# EasyEDA Pro project sfy3-v3.1.4.epro, board PCB_sfy3
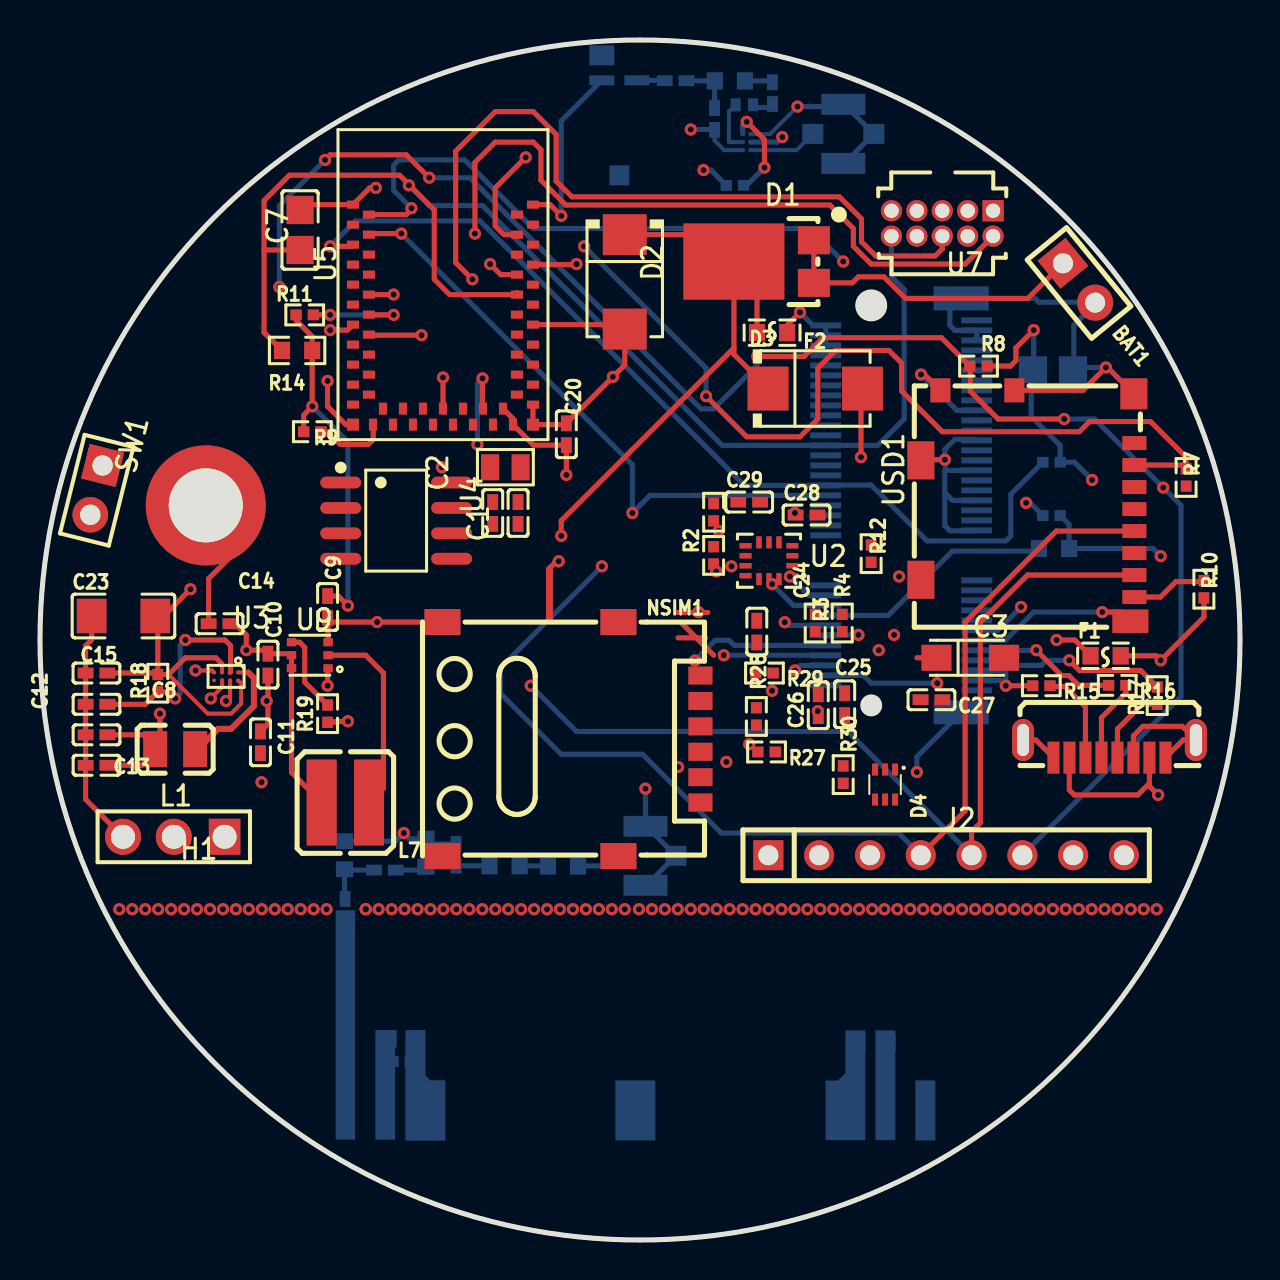
[diagram p30: board, top side]
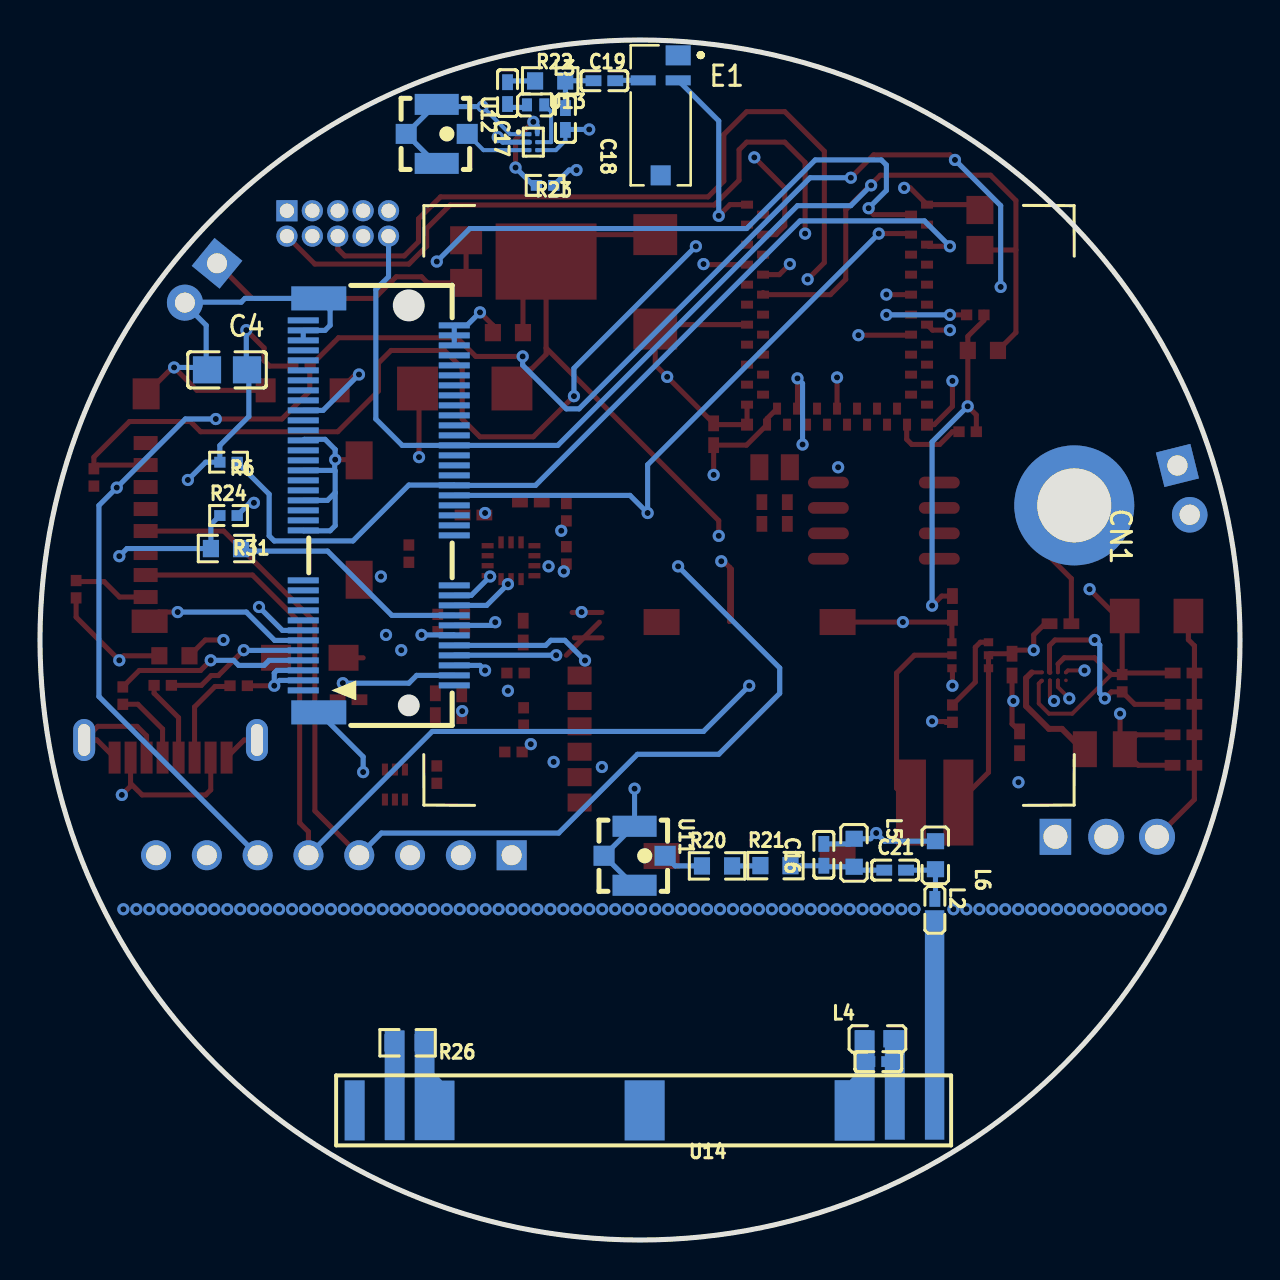
[diagram p31: board, bottom side, seen from below]

Outline 60 x 60 mm; copper layers: Top Layer, GND, POWER, Bottom Layer. Coordinates in mm from the lower left corner of the outline.
Outline path: circle c30,30 r30
Stack: Top Layer 0.035mm 外层铜厚1oz / Dielectric1 0.2104mm 7628 RC49% 8.6mil / GND 0.0152mm 内层铜厚 / Dielectric2 1.065mm 1.1mm H/HOZ 含铜 / POWER 0.0152mm 内层铜厚 / Dielectric3 0.2104mm 7628 RC49% 8.6mil / Bottom Layer 0.035mm 外层铜厚1oz

## Design rules (mm)
template: User Custom Config
spacing Default (default): track to track 0.152, other pairs 0 to 0.152
track width Default (default): min 0.254, default 0.254, max 25.4
differential pair differentialPair (default): width min 0.127, default 0.254, max 2.54; gap min 0.152, default 0.152
via Default (default): diameter min 0.61, default 0.61, max 100.025; hole min 0.305, default 0.305, max 59.995

## Placement (name value [footprint] x y rotation side)
BAT1  22284020  [HDR-TH_2P-P2.54-V-M-1]  51.95 47.85 309.3 top
C1  15pF  [C0402]  23.9 36.35 270 top
C2  15pF  [C0402]  22.63 36.35 270 top
C3  10uF  [CAP-SMD_L3.2-W1.6-RD]  46.51 29.11 0 top
C4  100nF  [C0805]  50.65 43.51 180 bottom
C7  1nF  [C0805]  13 50.5 90 top
C8  100nF  [C0402]  2.83 26.78 180 top
C9  100nF  [C0402]  14.38 31.65 270 top
C10  100nF  [C0402]  11.4 28.77 270 top
C11  10uF  [C0402]  11.02 24.88 90 top
C12  10uF  [C0402]  2.83 25.26 180 top
C13  10uF  [C0402]  2.83 23.74 180 top
C14  10uF  [C0402]  8.98 30.81 180 top
C15  4.7uF  [C0402]  2.82 28.35 0 top
C16  1pF  [C0402]  20.81 19.26 270 bottom
C17  1nF  [C0402]  36.62 57.34 90 bottom
C18  4.6pF  [C0402]  33.73 56.05 90 bottom
C19  1.1pF  [C0402]  31.78 57.96 180 bottom
C20  1uF  [C0402]  26.32 40.29 270 top
C21  2.2pF  [C0402]  17.24 18.49 180 bottom
C22  0.5pF  [C0402]  18.09 8.92 0 bottom
C23  47uF  [C1206]  4.17 31.2 0 top
C24  100nF  [C0402]  35.84 30.42 270 top
C25  33pF  [C0402]  40.23 26.79 90 top
C26  33pF  [C0402]  38.91 26.74 90 top
C27  33pF  [C0402]  44.57 27.01 180 top
C28  100nF  [C0402]  38.33 36.25 0 top
C29  100nF  [C0402]  35.46 36.9 0 top
CN1  NOTECARD CONNECTOR  [NOTECARD-ext]  9.81 36.73 270 bottom
D1  FSV1045V  [TO-277A_L6.1-W4.6-P2.13-LS6.5-TR]  36.7 48.92 0 top
D2  SM6T6V8A  [SMB_L4.6-W3.6-LS5.3-RD]  29.24 47.91 270 top
D3  STPS3H100U  [SMB_L4.6-W3.6-LS5.3-RD]  38.76 42.57 0 top
D4  CESDLC5V0M5  [SOT-563_L1.6-W1.2-P0.50-LS1.6-BR]  42.25 22.77 90 top
E1  -  [NN03-320]  28.97 56.23 90 bottom
F1  046701.5NRHF  [F0603]  53.28 29.21 0 top
F2  F0603FA3500V032T  [F0603]  36.6 45.37 180 top
H1  Header-Male-2.54_1x3  [HDR-TH_3P-P2.54-V-M-1]  6.69 20.16 180 top
J2  Header2.54mm 1*8P  [HDR-TH_8P-P2.54-V-M]  45.31 19.24 0 top
L1  2.2uH  [L0806]  6.76 24.54 0 top
L2  2.3nH  [L0402]  15.26 16.51 270 bottom
L3  7.5nH  [IND-SMD_L1.0-W0.6]  35.22 56.76 0 bottom
L4  12nH  [L0603]  18.14 10.06 0 bottom
L5  10nH  [L0603]  19.29 19.36 90 bottom
L6  8.4nH  [L0603]  15.23 19.24 90 bottom
L7  2.2uH  [IND-SMD_L4.0-W4.0_XAL4040-103]  15.27 21.87 180 top
NSIM1  SMN-305  [SIM-SMD_SMN-305]  26.57 25.05 270 top
R2  10kΩ  [R0402]  33.68 34.23 90 top
R3  10kΩ  [R0402]  38.76 30.85 270 top
R4  10kΩ  [R0402]  40.11 30.85 270 top
R5  10kΩ  [R0402]  33.68 36.39 270 top
R6  10kΩ  [R0402]  50.57 38.89 0 bottom
R7  10kΩ  [R0402]  57.31 38.13 270 top
R8  10kΩ  [R0402]  46.93 43.7 0 top
R9  10kΩ  [R0402]  13.62 40.41 180 top
R10  10kΩ  [R0402]  58.19 32.54 270 top
R11  10kΩ  [R0402]  13.24 46.26 180 top
R12  10kΩ  [R0402]  41.56 34.32 270 top
R14  100kΩ  [R0603]  12.86 44.48 0 top
R15  5.1kΩ  [R0402]  50.07 27.71 180 top
R16  22Ω  [R0402]  53.86 27.73 180 top
R17  22Ω  [R0402]  55.86 27.22 90 top
R18  10MΩ  [R0402]  5.89 27.84 90 top
R19  82kΩ  [R0402]  14.38 26.32 90 top
R20  0Ω  [R0603]  26.15 18.7 180 bottom
R21  0Ω  [R0603]  23.23 18.72 180 bottom
R22  0Ω  [R0603]  34.49 57.95 180 bottom
R23  200kΩ  [R0402]  34.74 52.73 180 bottom
R24  100kΩ  [R0402]  50.57 36.22 180 bottom
R26  0Ω  [R0603]  41.62 9.86 0 bottom
R27  22Ω  [R0402]  36.33 24.4 180 top
R28  22Ω  [R0402]  35.82 26.18 270 top
R29  22Ω  [R0402]  36.22 28.35 180 top
R30  15kΩ  [R0402]  40.16 23.27 270 top
R31  0Ω  [R0603]  50.7 34.57 0 bottom
SW1  M.sw.  [2P]  2.82 37.49 256 top
U2  ISM330DHCXTR  [LGA-14_L3.0-W2.5-P0.50-BR]  36.45 33.96 0 top
U3  TPS62748YFPT  [DSBGA-8_L1.6-W0.9-R2-C4-P0.40-BL]  9.3 28.18 180 top
U4  DS2482S-100+T&R  [SOIC-8_L4.9-W3.9-P1.27-LS6.0-BL]  17.81 35.97 270 top
U5  SPARKFUN ARTEMIS BLE MODULE  [ARTEMIS_BLE]  15.65 40.77 90 top
U6  32.768kHz  [CRYSTAL-SMD_L2.0-W1.2]  23.27 38.64 180 top
U7  FTSH-105-01-F-D-K  [CONN-TH_10P-P1.27_FTSH-105-01-F-D-K]  45.11 50.83 180 top
U9  MAX17225ELT+T  [UDFN-6_L2.0-W2.0-P0.65-BL]  13.49 29.24 90 top
U11  CONMHF1-SMD-G-T  [RF-SMD_CONMHF1-SMD-G-T]  30.27 19.21 270 bottom
U12  CONMHF1-SMD-G-T  [RF-SMD_CONMHF1-SMD-G-T]  40.16 55.31 270 bottom
U13  BGA725L6E6327FTSA1  [TSLP-6_L1.1-W0.7-P0.40-BR]  35.33 54.89 0 bottom
U14  -  [NN03-310-NoSilk]  15.27 6.5 0 bottom
USB1  YTC-TC8S-125  [USB-C-SMD_YIYUAN_YTC-TC8S-125]  53.47 24.56 0 top
USD1  1040310811  [SIM-SMD_8P-1040310811]  49.38 36.71 90 top

## Footprints (pads in the part's own frame, mm; a bottom-side part is the same pattern mirrored in y, then rotated)
2P
  rect 1.778x1.778 hole 1.016: 1(-1.27,0)
  round 1.778 hole 1.016: 2(1.27,0)
ARTEMIS_BLE
  rect 0.4x0.6 smd: 1(11,0) 2(10.5,-0.8) 3(10,0) 4(9.5,-0.8) 5(9,0) 6(8.5,-0.8) 7(8,0) 8(7.5,-0.8) 9(7,0) 10(6.5,-0.8) 11(6,0) 12(5.5,-0.8) 13(5,0) 14(4.5,-0.8) 15(4,0) 16(3.5,-0.8) 17(3,0) 18(2.5,-0.8) 19(2,0) 20(1.5,-0.8) 21(1,0) 39(1,-8.999) 40(1.5,-8.2) 41(2,-8.999) 42(2.5,-8.2) 43(3,-8.999) 44(3.5,-8.2) 45(4,-8.999) 46(4.5,-8.2) 47(5,-8.999) 48(5.5,-8.2) 49(6,-8.999) 50(6.5,-8.2) 51(7,-8.999) 52(7.5,-8.2) 53(8,-8.999) 54(8.5,-8.2) 55(9,-8.999) 56(9.5,-8.2) 57(10,-8.999) 58(10.5,-8.2) 59(11,-8.999)
  rect 0.6x0.6 smd: 22(0,0) 38(0,-8.999)
  rect 0.6x0.4 smd: 23(0,-1) 24(0.8,-1.5) 25(0,-2) 26(0.8,-2.5) 27(0,-2.999) 28(0.8,-3.5) 29(0,-3.999) 30(0.8,-4.5) 31(0,-5) 32(0.8,-5.5) 33(0,-6) 34(0.8,-6.5) 35(0,-7) 36(0.8,-7.5) 37(0,-8)
C0402
  rect 0.79x0.54 smd: 1(-0.545,0) 2(0.545,0)
C0805
  rect 1.41x1.35 smd: 1(-1,0) 2(1,0)
C1206
  rect 1.485x1.728 smd: 1(-1.593,0) 2(1.593,0)
CAP-SMD_L3.2-W1.6-RD
  rect 1.5x1.296 smd: 1(-1.687,0) 2(1.687,0)
CONN-TH_10P-P1.27_FTSH-105-01-F-D-K
  rect 1.06x1.06 hole 0.715x0.71: 1(-2.54,-0.635)
  round 1.06 hole 0.715x0.71: 2(-2.54,0.635) 3(-1.27,-0.635) 4(-1.27,0.635) 5(0,-0.635) 6(0,0.635) 7(1.27,-0.635) 8(1.27,0.635) 9(2.54,-0.635) 10(2.54,0.635)
CRYSTAL-SMD_L2.0-W1.2
  rect 0.9x1.3 smd: 1(-0.762,0) 2(0.762,0)
DSBGA-8_L1.6-W0.9-R2-C4-P0.40-BL
  round 0.184 smd: A1(-0.6,-0.2) A2(-0.6,0.2) B1(-0.2,-0.2) B2(-0.2,0.2) C1(0.2,-0.2) C2(0.2,0.2) D1(0.6,-0.2) D2(0.6,0.2)
F0603
  rect 0.806x0.864 smd: 1(-0.753,0) 2(0.753,0)
HDR-TH_2P-P2.54-V-M-1
  rect 1.8x1.8 hole 1: 1(-1.27,0)
  round 1.8 hole 1: 2(1.27,0)
HDR-TH_3P-P2.54-V-M-1
  rect 1.575x1.8 hole 1.2: 1(-2.54,0)
  round 1.8 hole 1.2: 2(0,0) 3(2.54,0)
HDR-TH_8P-P2.54-V-M
  rect 1.5x1.5 hole 1: 1(-8.89,0)
  round 1.5 hole 1: 2(-6.35,0) 3(-3.81,0) 4(-1.27,0) 5(1.27,0) 6(3.81,0) 7(6.35,0) 8(8.89,0)
IND-SMD_L1.0-W0.6
  rect 0.5x0.648 smd: 1(-0.434,0) 2(0.434,0)
IND-SMD_L4.0-W4.0_XAL4040-103
  rect 1.5x4.3 smd: 1(-1.185,0) 2(1.185,0)
L0402
  rect 0.79x0.54 smd: 1(-0.545,0) 2(0.545,0)
L0603
  rect 0.8x0.864 smd: 1(-0.7,0) 2(0.7,0)
L0806
  rect 1.2x1.8 smd: 1(-1,0) 2(1,0)
LGA-14_L3.0-W2.5-P0.50-BR
  rect 0.6x0.27 smd: 1(1.17,-0.75) 2(1.17,-0.25) 3(1.17,0.25) 4(1.17,0.75) 8(-1.17,0.75) 9(-1.17,0.25) 10(-1.17,-0.25) 11(-1.17,-0.75)
  rect 0.27x0.6 smd: 5(0.5,0.92) 6(0,0.92) 7(-0.5,0.92) 12(-0.5,-0.92) 13(0,-0.92) 14(0.5,-0.92)
NN03-310-NoSilk
  custom 0.97x11.48 smd: 1(0.003,-4.242)
  custom 0.992x5.499 smd: 2(1.994,-1.238)
  custom 2.001x5.513 smd: 3(4,-1.22)
  rect 2x3 smd: 4(14.5,0.025)
  custom 1.986x5.486 smd: 5(25.003,-1.232)
  custom 0.992x5.486 smd: 6(27,-1.232)
  rect 1x3 smd: 7(29,0.025)
NN03-320
  rect 1x1 smd: 1(-3,0)
  custom 0.5x1.25 smd: 2(1.75,-0.875) 4(1.75,0.875)
  custom 1x1.25 smd: 3(3,-0.875)
NOTECARD-ext
  round 6 hole 3.7: 0(0,1.524)
  rect 0.3x1.55 smd: 1(9.25,-37.025) 2(9,-29.475) 3(8.751,-37.025) 4(8.5,-29.475) 5(8.25,-37.025) 6(8,-29.475) 7(7.75,-37.025) 8(7.5,-29.475) 9(7.25,-37.025) 10(7,-29.475) 11(6.75,-37.025) 12(6.5,-29.475) 13(6.25,-37.025) 14(6,-29.475) 15(5.75,-37.025) 16(5.5,-29.475) 17(5.25,-37.025) 18(5,-29.475) 19(4.75,-37.025) 20(4.5,-29.475) 21(4.25,-37.025) 22(4,-29.475) 23(3.751,-37.025) 32(1.5,-29.475) 33(1.25,-37.025) 34(1,-29.475) 35(0.75,-37.025) 36(0.5,-29.475) 37(0.25,-37.025) 38(0.001,-29.475) 39(-0.249,-37.025) 40(-0.5,-29.475) 41(-0.75,-37.025) 42(-1,-29.475) 43(-1.25,-37.025) 44(-1.5,-29.475) 45(-1.75,-37.025) 46(-2,-29.475) 47(-2.249,-37.025) 48(-2.5,-29.475) 49(-2.75,-37.025) 50(-2.999,-29.475) 51(-3.249,-37.025) 52(-3.5,-29.475) 53(-3.75,-37.025) 54(-3.999,-29.475) 55(-4.25,-37.025) 56(-4.5,-29.475) 57(-4.75,-37.025) 58(-5,-29.475) 59(-5.25,-37.025) 60(-5.5,-29.475) 61(-5.75,-37.025) 62(-6,-29.475) 63(-6.25,-37.025) 64(-6.5,-29.475) 65(-6.75,-37.025) 66(-7,-29.475) 67(-7.25,-37.025) 68(-7.5,-29.475) 69(-7.75,-37.025) 70(-8,-29.475) 71(-8.249,-37.025) 72(-8.5,-29.475) 73(-8.75,-37.025) 74(-8.999,-29.475) 75(-9.249,-37.025)
  rect 1.2x2.75 smd: 76(-10.35,-36.25) 77(10.35,-36.25)
R0402
  rect 0.566x0.54 smd: 1(-0.433,0) 2(0.433,0)
R0603
  rect 0.806x0.864 smd: 1(-0.753,0) 2(0.753,0)
RF-SMD_CONMHF1-SMD-G-T
  rect 1x1.05 smd: 1(0,1.525) 4(0,-1.525)
  rect 1.05x2.2 smd: 2(-1.475,0) 3(1.475,0)
SIM-SMD_8P-1040310811
  rect 0.7x1.2 smd: 1(3.138,-5.338) 2(2.038,-5.338) 3(0.938,-5.338) 4(-0.163,-5.338) 5(-1.262,-5.338) 6(-2.362,-5.338) 7(-3.462,-5.338) 8(-4.562,-5.338)
  rect 1.17x1.8 smd: 9(-5.772,-5.138)
  rect 1.55x1.35 smd: 10(5.598,-5.312)
  rect 1.2x1 smd: 11(5.772,0.662) 12(5.772,4.362)
  rect 1.9x1.35 smd: 13(2.272,5.338) 14(-3.697,5.338)
SIM-SMD_SMN-305
  rect 1.3x1.8 smd: 1(5.85,-6.45) 2(-5.85,-6.45) 3(5.85,2.35) 4(-5.85,2.35)
  rect 0.9x1.2 smd: C1(-3.175,6.45) C2(-0.635,6.45) C3(1.905,6.45) C5(-1.905,6.45) C6(0.635,6.45) C7(3.175,6.45)
SMB_L4.6-W3.6-LS5.3-RD
  rect 2.047x2.192 smd: 1(-2.361,0) 2(2.361,0)
SOIC-8_L4.9-W3.9-P1.27-LS6.0-BL
  oval 0.588x2.045 smd: 1(-1.905,-2.772) 2(-0.635,-2.772) 3(0.635,-2.772) 4(1.905,-2.772) 5(1.905,2.772) 6(0.635,2.772) 7(-0.635,2.772) 8(-1.905,2.772)
SOT-563_L1.6-W1.2-P0.50-LS1.6-BR
  rect 0.6x0.3 smd: 1(0.75,-0.5) 2(0.75,0) 3(0.75,0.5) 4(-0.75,0.5) 5(-0.75,0) 6(-0.75,-0.5)
TO-277A_L6.1-W4.6-P2.13-LS6.5-TR
  rect 1.6x1.4 smd: 1(2,1.065) 2(2,-1.065)
  rect 5.05x3.81 smd: 3(-2,0)
TSLP-6_L1.1-W0.7-P0.40-BR
  rect 0.2x0.2 smd: 1(0.2,-0.4) 2(0.2,0) 3(0.2,0.4) 4(-0.2,0.4) 5(-0.2,0) 6(-0.2,-0.4)
UDFN-6_L2.0-W2.0-P0.65-BL
  rect 0.4x0.47 smd: 1(-0.65,-0.915) 2(0,-0.915) 3(0.65,-0.915) 4(0.65,0.915) 5(0,0.915) 6(-0.65,0.915)
USB-C-SMD_YIYUAN_YTC-TC8S-125
  oval 1.1x2.1 hole 0.6x1.6: 10(4.32,0.44) 11(-4.32,0.44)
  rect 0.6x1.6 smd: A5(-1.2,-0.44) A8(1.2,-0.44) A9(2,-0.44) A12(2.8,-0.44) B6(0.4,-0.44) B7(-0.4,-0.44) B9(-2,-0.44) B12(-2.8,-0.44)

## Nets
As in the schematic.

Pads without a net: CN1 1 15 17 19 21 22 23 32 34 35 36 37 38 41 43 44 46 47 48 49 52 53 54 55 56 58 59 60 61 62 63 64 65 66 67 68 69 75; D4 1; E1 1 3; J2 3 8; NSIM1 C6; U2 2 3 4 9 10 11; U3 D2; U4 6; U5 3 6 7 8 9 11 15 16 17 18 19 20 21 24 25 26 27 28 29 31 32 33 40 41 42 43 44 45 46 48 49 51 54 55 57 58; U7 7 8; U14 4 7

## Via types
v1: diameter 0.61, hole 0.305, Top Layer to Bottom Layer, 180 vias

## Routing (per net, layer and track width the routed paths; a pad name or vN(x,y) marks a point on that pad's centre or on a via; arc(x,y) is an arc through that point)
1V8: length 27.2
  Top Layer w0.2: v1(8.54,27.08) 9.1,27.65 9.1,27.98
  Top Layer w0.254: 5.89,24.54 5.08,23.74 3.37,23.74 ; 5.89,24.54 6,24.65 v1(6,26.32) ; 5.89,24.54 5.17,25.26 3.37,25.26 ; C14.1 9.76,30.81 10.32,30.25 v1(10.32,29.49) 11.22,29.49 C10.1 12.5,29.31 U9.5 U9.6 12.58,23.38 L7.2
  POWER w0.254: v1(10.32,29.49) 9.55,29.49 8.54,28.48 v1(8.54,27.08) 7.78,26.32 v1(6,26.32)
+3V3: length 152.3
  Top Layer w0.254: U9.1 14.38,28.56 v1(14.38,27.71) ; 12.8,46.38 12.8,45.99 13.61,45.18 R14.2 13.61,41.69 v1(13.62,41.68) 13.18,41.25 R9.2 ; R10.2 58.19,31.14 v1(56.03,28.98) 55.81,29.21 F1.2 ; v1(49.69,45.49) 48.8,44.61 48.8,43.97 48.52,43.7 R8.2 ; v1(15.4,31.72) 14.92,32.2 C9.1 ; U5.36 23.65,41.07 U5.37 24.67,39.74 C20.2 v1(26.32,38.26) ; 43.84,29.11 C3.1
  POWER w0.254: H1.2 6.69,21.8 7.39,22.51 10.7,22.51 v1(11.08,22.89) 11.08,25.05 13.74,27.71 v1(14.38,27.71) 14.89,27.71 15.4,28.22 v1(15.4,31.72) 15.58,31.91 31.52,31.91 ; v1(32.92,31.4) 33.3,31.4 33.68,31.78 41.18,31.78 v1(42.7,30.25) 43.26,30.81 54.21,30.81 v1(56.03,28.98) ; v1(32.92,31.4) 32.79,31.4 ; v1(32.92,31.4) 29.37,27.84 29.37,25.05 35.17,19.24 J2.1 ; v1(32.92,31.4) 32.41,31.91 31.52,31.91 ; v1(49.69,45.49) 48.92,46.26 48.92,50.83 48.29,51.46 U7.1 47.65,51.97 45.75,53.88 38.38,53.88 v1(37.11,55.15) ; v1(26.32,38.26) 26.32,37.11 31.52,31.91
  Bottom Layer w0.254: v1(37.11,55.15) 36.86,54.89 U13.2 ; v1(52.61,38) 51.72,38.89 R6.2 51.01,39.73 49.56,41.18 49.56,43.42 C4.2 49.69,43.55 v1(49.69,45.49) ; v1(13.62,41.68) 15.4,39.91 v1(15.4,31.72)
GND: length 170.9
  Top Layer w0.2: 8.7,28.38 8.61,28.48 v1(7.78,28.48) ; 9.5,27.98 9.5,27.16 v1(9.3,26.95)
  Top Layer w0.254: USB1.11 49.79,25 USB1.B12 ; NSIM1.2 v1(16.86,30.9) 14.59,30.9 14.41,31.08 ; 25.52,33.63 25.43,33.54 25.43,31.02 25.52,30.93 25.52,33.63 ; 25.52,33.63 25.82,33.94 v1(25.94,33.94) ; 11.4,27.02 11.4,25.8 C11.2 ; 11.4,27.02 C10.2 ; 11.4,27.02 v1(11.33,26.95) ; v1(48.29,27.71) R15.2 ; C7.2 13.27,51.77 U5.1 16.49,52.61 v1(16.79,52.61) ; U5.47 29.02,45.77 D2.2 29.24,43.75 v1(28.64,43.16) C20.1 26.25,40.77 U5.38 U5.39 ; H1.3 2.28,22.03 C13.2 C12.2 C8.2 2.28,28.34 C15.1 2.28,29.71 2.58,30.01 C23.1 ; USD1.10 53.37,43.63 v1(53.3,43.63) 52.15,42.48 USD1.11 ; v1(53.11,31.4) 54.06,31.4 USD1.9 ; U5.59 25.5,51.77 v1(26.06,51.21) ; U9.3 14.41,31.08 ; 14.41,31.08 C9.2 ; v1(14.38,42.95) 14.38,41.68 15.29,40.77 U5.22 ; USB1.A8 54.67,25.21 55.15,25.68 57.11,25.68 USB1.10 57.15,25 USB1.A12 ; v1(15.4,25.94) 15.38,25.92 14.75,25.92 ; 9.81,36.73 9.81,34.45 8.43,33.07 C14.2 ; 14.75,25.92 14.71,25.88 R19.1 ; 14.75,25.92 14.33,25.92 ; v1(44.05,43.27) 44.23,43.27 USD1.12 ; 31.9,30.11 33.28,30.11 ; v1(45.24,39.02) 44.08,39.02
  Bottom Layer w0.2: U13.1 36.5,55.29 v1(37.87,56.67) ; C18.1 33.73,54.97 34.21,54.49 U13.4
  Bottom Layer w0.254: C18.1 33.71,55.53 v1(32.54,55.53) ; 51.69,43.55 51.77,43.63 v1(53.3,43.63) ; 51.69,43.55 51.69,45.73 52.79,46.84 ; 51.69,43.55 51.69,43.51 ; BAT1.2 52.73,46.89 49.94,46.89 49.75,47.08 CN1.76 45.49,46.51 45.49,45.73 45.75,45.48 CN1.73 CN1.71 ; C16.1 19.55,19.8 L5.2 18.47,20.06 v1(18.19,20.35) 17.78,19.94 L6.2 ; CN1.39 45.63,36.98 45.24,37.37 ; CN1.45 45.27,38.48 ; 45.27,38.48 45.24,38.45 45.24,37.37 ; 45.27,38.48 45.27,38.99 v1(45.24,39.02) 45.24,39.53 45.75,40.03 46.78,40.03 CN1.51 ; CN1.18 37.67,31.73 v1(36.6,32.79) ; v1(26.06,51.21) 26.06,55.95 28.09,57.98 ; CN1.33 46.82,35.46 45.49,35.46 45.24,35.72 45.24,37.37 ; CN1.6 38,28.73 v1(37.75,28.48) ; CN1.57 45.84,41.48 v1(44.05,43.27) ; v1(37.87,56.67) 40.05,56.67 U12.2 40.21,56.78 U12.4 40.21,53.83 U12.3 ; v1(56.03,34.19) 55.65,34.57 R31.2 51.45,35.78 R24.1 ; CN1.3 48.02,27.98 v1(48.29,27.71) 48.29,28.35 48.16,28.48 CN1.5 ; 46.06,26.38 43.84,24.16 v1(43.84,23.4) ; U11.3 30.32,17.74 U11.4 30.32,20.69 U11.2 v1(30.27,22.57) ; 51.66,43.36 51.73,43.43 ; v1(53.11,31.4) 49.69,31.4 48.27,29.98 CN1.11
  vias: v1(3.97,16.54) v1(4.61,16.54) v1(5.26,16.54) v1(5.91,16.54) v1(6.56,16.54) v1(7.2,16.54) v1(7.85,16.54) v1(8.5,16.54) v1(9.15,16.54) v1(9.79,16.54) v1(10.44,16.54) v1(11.09,16.54) v1(11.74,16.54) v1(12.39,16.54) v1(13.03,16.54) v1(13.68,16.54) v1(14.33,16.54) v1(16.28,16.54) v1(16.28,16.54) v1(16.93,16.54) v1(17.58,16.54) v1(18.23,16.54) v1(18.88,16.54) v1(19.52,16.54) v1(20.09,38.64) v1(20.17,16.54) v1(20.82,16.54) v1(21.47,16.54) v1(22.11,16.54) v1(22.76,16.54) v1(23.41,16.54) v1(24.06,16.54) v1(24.7,16.54) v1(25.35,16.54) v1(26,16.54) v1(26.65,16.54) v1(27.3,16.54) v1(27.94,16.54) v1(28.59,16.54) v1(29.24,16.54) v1(29.95,16.54) v1(30.59,16.54) v1(31.24,16.54) v1(31.89,16.54) v1(32.54,16.54) v1(33.19,16.54) v1(33.83,16.54) v1(33.94,35.46) v1(34.48,16.54) v1(35.13,16.54) v1(35.46,24.79) v1(35.78,16.54) v1(36.42,16.54) v1(37.07,16.54) v1(37.72,16.54) v1(38.37,16.54) v1(39.01,16.54) v1(39.66,16.54) v1(40.31,16.54) v1(40.96,16.54) v1(41.61,16.54) v1(42.22,16.54) v1(42.87,16.54) v1(42.95,33.17) v1(43.51,16.54) v1(44.16,16.54) v1(44.81,16.54) v1(45.46,16.54) v1(46.1,16.54) v1(46.75,16.54) v1(47.4,16.54) v1(48.05,16.54) v1(48.69,16.54) v1(49.34,16.54) v1(49.99,16.54) v1(50.64,16.54) v1(51.28,16.54) v1(51.93,16.54) v1(52.58,16.54) v1(53.23,16.54) v1(53.88,16.54) v1(54.54,16.54) v1(55.18,16.54) v1(55.83,16.54)
VBAT: length 15.9
  Top Layer w0.254: 51.15,48.83 49.39,47.08 43.27,47.08 42.19,48.16 40.92,48.16 40.62,47.86 D1.2 D1.1
I_SCL: length 20.4
  Top Layer w0.254: U5.53 26.8,48.77 v1(26.83,48.8)
  POWER w0.254: v1(33.81,33.43) 27.71,39.53 27.71,47.91 v1(26.83,48.8)
I_SDA: length 24.8
  Top Layer w0.254: U5.52 23.03,48.27 v1(22.51,48.8)
  POWER w0.254: v1(34.57,33.68) 34.57,33.05 34.19,32.67 32.29,32.67 27.08,37.87 27.08,42.95 23.27,46.76 23.27,48.03 v1(22.51,48.8)
NC_SCL: length 30.4
  Top Layer w0.254: v1(18.06,50.32) 16.5,50.32 U5.4
  Bottom Layer w0.254: CN1.40 30.5,37.23 v1(29.62,36.35) 29.62,38.76 v1(18.06,50.32)
NC_SDA: length 46.8
  Top Layer w0.254: v1(14.51,49.69) 15.56,49.69 U5.5
  Bottom Layer w0.254: R6.1 48.54,37.29 48.54,35.21 48.29,34.95 44.35,34.95 41.56,37.75 39.3,37.75 CN1.42 35.22,37.73 22,50.95 15.78,50.95 v1(14.51,49.69)
NRESET: length 67.6
  Top Layer w0.254: 11.2,49.5 C7.1 ; 11.2,49.5 11.2,51.97 12.47,53.24 17.98,53.24 19.71,51.51 19.71,48.03 20.48,47.27 U5.50 23.85,47.37 ; 11.2,49.5 11.2,45.38 R14.1
  Bottom Layer w0.254: v1(18.44,52.73) 19.46,51.72 22.13,51.72 34.11,39.73 CN1.50 41.89,39.73 43.21,41.05 43.21,47.53 42.57,48.16 U7.10
PT_CS: length 43
  Top Layer w0.254: v1(24.28,54.13) 22.76,52.61 22.76,50.7 23.19,50.27 U5.56
  POWER w0.254: v1(24.28,54.13) 37.75,40.67 v1(37.75,36.35) ; J2.7 51.66,19.77 v1(41.94,29.49)
SD_CD: length 58.4
  Top Layer w0.254: v1(33.3,42.19) 35.33,40.16 38,40.16 38.89,41.05 38.89,43.59 39.78,44.48 42.45,44.48 43.08,43.84 43.08,42.45 45.11,40.41 51.97,40.41 52.48,40.92 55.53,40.92 57.31,39.14 R7.1 57.12,38.75 54.72,38.75 ; U5.14 16.48,45.24 v1(19.08,45.24)
  POWER w0.254: v1(19.08,45.24) 19.71,45.88 19.71,47.53 21.87,49.69 v1(27.21,49.69)
  Bottom Layer w0.254: v1(27.21,49.69) 33.3,43.59 v1(33.3,42.19)
SD_MISO: length 49.8
  Top Layer w0.254: J2.5 46.58,20.42 47.02,20.86 47.02,30.89 49.38,33.25 54.72,33.25 ; U5.23 16.67,40.75 16.67,40.03 16.41,39.78 15.01,39.78 14.38,40.41 R9.1
  Bottom Layer w0.254: v1(24.54,27.71) 26.83,25.43 40.39,25.43 J2.5
SD_MOSI: length 87.4
  Top Layer w0.254: U5.13 15.37,45.49 v1(14.51,45.49) ; v1(51.21,41.05) 47.91,41.05 46.51,42.45 46.51,43.68 R8.1 45.08,45.11 39.14,45.11 38.21,44.18 v1(35.87,44.18) ; v1(14.25,54) 14.51,54.26 18.32,54.26 v1(19.46,53.11)
  POWER w0.254: v1(11.97,47.65) 11.97,46.64 13.11,45.49 v1(14.51,45.49)
  Bottom Layer w0.254: v1(51.21,41.05) 52.73,41.05 v1(56.16,37.62) 57.05,36.73 57.05,27.17 v1(49.12,19.24) ; v1(19.46,53.11) 21.49,53.11 33.05,41.56 33.68,41.56 35.87,43.74 v1(35.87,44.18) ; v1(11.97,47.65) 11.97,51.72 v1(14.25,54)
SD_SCK: length 80.2
  Top Layer w0.254: U5.12 16.46,46.26 v1(17.68,46.26) ; v1(14.51,46.26) R11.1 ; 54.72,35.45 50.81,35.45 46.26,30.89 46.26,21.46 J2.4
  POWER w0.254: v1(28.09,33.68) 28.09,34.12 23.14,39.07 23.14,40.92 22.51,41.56 18.57,41.56 17.68,42.45 v1(17.68,46.26)
  Bottom Layer w0.254: v1(14.51,46.26) v1(17.68,46.26) ; v1(28.09,33.68) 23.02,28.6 23.02,27.33 26.06,24.28 30.13,24.28 34.06,20.35 42.93,20.35 J2.4
SIM_CLK: length 2.1
  Bottom Layer w0.254: CN1.14 37.4,30.73 v1(37.24,30.89)
SIM_IO: length 15.7
  POWER w0.254: v1(31.91,23.65) 31.91,23.52 32.41,23.02 36.6,23.02 40.92,27.33 v1(40.92,30.25)
  Bottom Layer w0.254: CN1.12 39.31,30.25 v1(40.92,30.25)
SIM_RST: length 7.1
  Bottom Layer w0.254: v1(32.75,28.97) 33.76,29.98 34.46,29.98 34.71,29.73 CN1.10
SIM_VCC: length 20.2
  Top Layer w0.254: 33.68,29.24 32.03,30.89 ; 31.9,31.38 33.39,31.38
  POWER w0.254: v1(34.32,23.9) 34.32,29.11 v1(34.19,29.24) 36.1,29.24 v1(38.89,26.44)
  Bottom Layer w0.254: CN1.8 39.28,29.24 v1(34.19,29.24)
SWDCLK: length 36.9
  Top Layer w0.254: U5.2 18.32,51.27 18.57,51.52 v1(18.57,51.59)
  POWER w0.254: U7.4 46.38,49.18 46.13,48.92 v1(40.16,48.92)
  Bottom Layer w0.254: v1(40.16,48.92) 38.51,50.57 24.67,50.57 21.24,54 17.94,54 17.68,53.75 17.68,52.48 v1(18.57,51.59)
SWDIO: length 41
  Top Layer w0.254: U7.2 46.26,48.8 41.56,48.8 40.67,49.69 40.67,50.57 39.49,51.75 26.28,51.75 25.05,52.99 25.05,54.51 24.67,54.89 22.76,54.89 21.75,53.88 v1(21.75,50.32) ; v1(17.68,47.27) 17.68,47.27 U5.10
  POWER w0.254: v1(21.75,50.32) 18.7,47.27 v1(17.68,47.27)
SWO: length 44.8
  Top Layer w0.254: U7.6 45.11,49.56 44.76,49.2 41.79,49.2 41.07,49.91 41.07,51.06 39.97,52.16 26.6,52.16 25.81,52.94 25.81,55.27 24.67,56.42 22.76,56.42 20.78,54.44 20.78,48.87 v1(21.62,48.03) ; U5.30 v1(20.15,43.13)
  POWER w0.254: v1(20.15,43.13) 20.15,46.56 v1(21.62,48.03)
USBD+: length 9.8
  Top Layer w0.254: v1(51.46,28.98) 51.97,28.48 55.03,28.48 R17.2
  Bottom Layer w0.254: CN1.7 48.55,28.98 48.8,28.73 50.07,28.73 50.32,28.98 v1(51.46,28.98)
USBD-: length 7.3
  Top Layer w0.254: v1(49.81,29.49) 51.08,28.22 51.44,28.22 51.93,27.73 R16.2
  Bottom Layer w0.254: CN1.9 49.8,29.48 v1(49.81,29.49)
VACT_GPS_OUT: length 27
  POWER w0.254: v1(37.49,33.17) 37.49,33.94 39.02,35.46 39.02,43.59 33.18,49.43 v1(33.18,53.5)
  Bottom Layer w0.254: CN1.20 38.44,32.23 v1(37.49,33.17) ; R23.2 33.55,53.5 v1(33.18,53.5)
VMAIN: length 67.5
  Top Layer w0.2: 9.1,28.38 9.1,28.8 ; 6.43,28.27 8.39,26.32 9.55,26.32 10.06,26.83 10.06,27.82 9.93,27.95 9.91,27.95
  Top Layer w0.254: D1.3 33.35,50.27 D2.1 ; D1.3 34.7,44.6 ; D1.3 35.85,47.77 F2.2 ; 9.1,28.8 8.79,29.11 7.27,29.11 6.43,28.27 R18.2 ; v1(26.06,35.21) 26.06,35.97 34.7,44.6 ; R18.2 5.82,28.35 C15.2 ; R18.2 5.89,31.08 5.77,31.2 6.18,31.2 v1(7.52,32.54) ; 34.7,44.6 34.7,44.28 D3.1
  POWER w0.254: v1(26.06,35.21) 23.4,32.54 v1(7.52,32.54)
VUSB: length 45
  Top Layer w0.254: v1(55.91,22.25) 55.47,22.69 55.47,22.83 ; v1(41.05,39.14) 41.05,42.5 D3.2 ; USB1.A9 55.47,22.83 ; 55.47,22.83 54.89,22.25 51.72,22.25 51.46,22.51 51.46,24.11 USB1.B9
  POWER w0.254: v1(41.05,39.14) 41.05,37.24 46.64,31.65 v1(49.05,31.65) 49.56,32.16 56.8,32.16 57.31,31.65 57.31,28.22 55.91,26.83 v1(55.91,22.25)
  Bottom Layer w0.254: v1(49.05,31.65) 47.88,30.48 CN1.13
$1N5: length 3.8
  Top Layer w0.254: v1(38,46.38) 37.36,45.74 F2.1
  Bottom Layer w0.254: v1(38,46.38) 38.65,45.73 CN1.74 CN1.72 CN1.70
$1N27: length 12
  Bottom Layer w0.254: CN1.16 42.41,31.23 45.62,34.45 49.82,34.45 R31.1
$1N1900: length 3.4
  Bottom Layer w0.2: U13.3 37.83,54.49 U12.1
$1N1978: length 1.4
  Bottom Layer w0.254: C19.2 31.22,57.98 E1.4
$1N2069: length 2.7
  Bottom Layer w0.2: L3.1 34.45,56.42 34.45,54.89 U13.5
$1N2072: length 1
  Bottom Layer w0.254: 35.65,56.63 36.45,56.63 C17.1
$1N2075: length 1.4
  Bottom Layer w0.254: R22.1 36.56,57.95 C17.2
$1N2105: length 2.8
  Bottom Layer w0.254: C19.1 33.73,57.96 R22.2 33.73,57.95 C18.2
$1N2207: length 28.4
  Top Layer w0.254: v1(36.22,53.62) 36.22,55.02 v1(35.33,55.91)
  POWER w0.254: v1(49.3,36.86) 48.67,36.86 36.22,49.3 v1(36.22,53.62)
  Bottom Layer w0.254: v1(35.33,55.91) 35.13,55.71 35.13,55.37 ; v1(36.22,53.62) 35.33,52.73 R23.1 ; R24.2 49.51,36.86 v1(49.3,36.86)
$1N3253: length 2.1
  Bottom Layer w0.254: 26.9,18.7 28.24,18.7 U11.1
$1N3261: length 1.4
  Bottom Layer w0.254: R21.1 24,18.7 R20.2
$1N3697: length 4.8
  Bottom Layer w0.254: R21.2 22.47,18.71 C16.2 20.76,18.66 L5.1 19.12,18.49 17.79,18.49
$1N3711: length 3
  Bottom Layer w0.254: C21.2 15.27,18.49 L6.1 15.23,17.09 L2.1
$1N3824: length 14.8
  Top Layer w0.254: v1(50.83,30) 51.74,30 F1.1
  POWER w0.254: v1(44.86,27.84) 47.27,30.25 50.57,30.25 v1(50.83,30)
  Bottom Layer w0.254: v1(44.86,27.84) 41.56,27.84 41.17,28.23 CN1.4
$2N3: length 3.8
  Top Layer w0.254: 54.72,32.15 56.02,32.15 56.8,32.92 58.14,32.92 58.19,32.97
$3N3: length 4.9
  Top Layer w0.254: U5.34 22.13,41.59 v1(22.13,43.08)
  Bottom Layer w0.254: v1(21.87,39.77) 21.87,42.83 v1(22.13,43.08)
$4N6: length 6
  Top Layer w0.2: 10.41,28.38 9.9,28.38
  Top Layer w0.3: 7.89,24.54 8.9,25.56 9.55,25.56 10.7,26.7 10.7,28.09 10.41,28.38
$4N11: length 9.9
  Top Layer w0.254: U9.2 16.28,29.24 17.17,28.35 17.17,22.59 L7.1
$4N1576: length 4.1
  Top Layer w0.254: U9.4 12.98,29.89 13.24,29.63 13.24,27.89 R19.2
$4N2482: length 10.6
  Top Layer w0.254: 9.5,28.38 9.53,28.4 9.53,29.72 9.25,30 v1(7.27,30) ; 3.37,26.78 5.27,26.78 R18.1 6.43,27.41 v1(6.76,27.08)
  Bottom Layer w0.254: v1(7.27,30) 7.01,29.75 7.01,27.33 v1(6.76,27.08)
$5N369: length 4.7
  Top Layer w0.254: R15.1 50.54,27.68 51.25,27.68 52.27,26.65 USB1.A5
$5N370: length 3.9
  Top Layer w0.254: R17.1 55.11,26.79 53.87,25.55 USB1.B6
$5N371: length 4.1
  Top Layer w0.254: USB1.B7 53.07,26.11 54.3,27.34 R16.1
$5N5765:
  vias: v1(36.6,27.46)
$1N3308: length 7
  Bottom Layer w0.254: L2.2 15.27,15.95 15.27,8.97
$1N9751: length 1.8
  Bottom Layer w0.254: 40.82,9.86 40.82,8.1

## Copper pours and planes (outline as drawn; the poured copper is in the pictures)
GND on GND: 13.04,20.16 13.94,20.16 13.94,18.12 13.04,18.12
GND on GND: 53.6,24.24 54.16,24.24 54.16,22.38 53.6,22.38
GND on GND: 12.15,49.63 13.05,49.63 13.05,47.56 12.15,47.56
GND on GND: 4.62,34.17 7.63,34.17 7.63,27.9 4.62,27.9
GND on GND: 4.62,37.43 7.63,37.43 7.63,31.16 4.62,31.16
GND on GND: 43.9,24.49 45.77,24.49 45.77,23.44 43.9,23.44
GND on GND: 44.96,24.24 45.52,24.24 45.52,22.38 44.96,22.38
GND on GND: 48.44,50.95 50.08,50.95 50.08,49.15 48.44,49.15
GND on GND: 38.21,56.42 39.58,56.42 39.58,54.87 38.21,54.87
GND on GND: 11.9,20.16 13.93,20.16 13.93,19.27 11.9,19.27
GND on GND: 37.41,56.24 38.96,56.24 38.96,54.87 37.41,54.87
GND on GND: 12.15,49.63 14.21,49.63 14.21,48.72 12.15,48.72
GND on GND: 4.62,34.17 10.89,34.17 10.89,31.16 4.62,31.16
GND on GND: 49.18,50.95 50.98,50.95 50.98,49.32 49.18,49.32
GND on GND: 0.15,59.85 59.85,59.85 59.85,0.15 0.15,0.15
GND on GND: 37.59,55.62 38.96,55.62 38.96,54.07 37.59,54.07
GND on GND: 10.99,49.63 13.06,49.63 13.06,48.72 10.99,48.72
GND on GND: 38.21,55.62 39.76,55.62 39.76,54.25 38.21,54.25
GND on GND: 44.96,25.55 45.52,25.55 45.52,23.69 44.96,23.69
GND on GND: 53.6,25.55 54.16,25.55 54.16,23.69 53.6,23.69
GND on GND: 13.05,20.16 15.08,20.16 15.08,19.27 13.05,19.27
GND on GND: 52.54,24.49 54.41,24.49 54.41,23.44 52.54,23.44
GND on GND: 44.71,24.49 46.58,24.49 46.58,23.44 44.71,23.44
GND on GND: 1.36,34.17 7.63,34.17 7.63,31.16 1.36,31.16
GND on GND: 53.35,24.49 55.22,24.49 55.22,23.44 53.35,23.44

Small or netless copper shapes (teardrops, artwork), in the pictures only: 8 on GND
